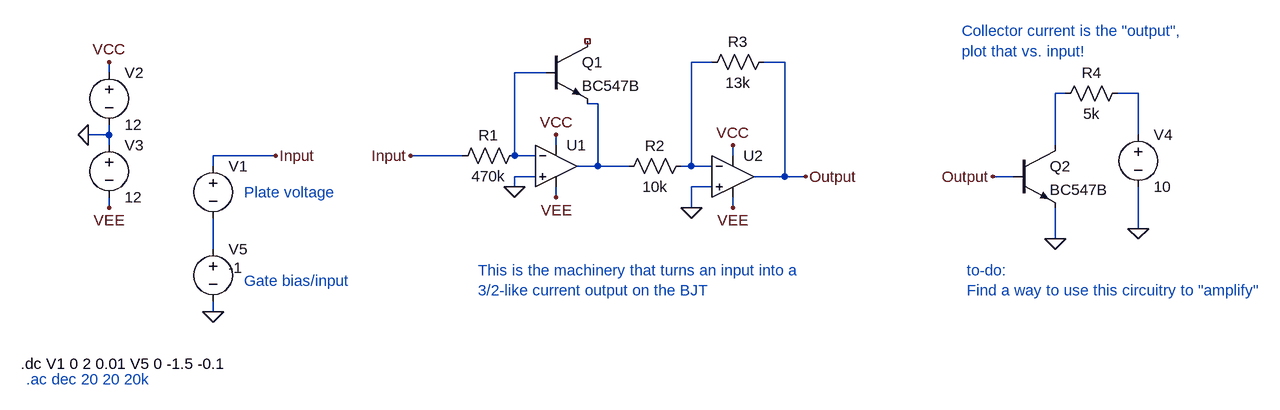
[diagram p0: schematic IV_family.asc]
IV_family.asc, the LTspice schematic file:
Version 4
SHEET 1 2184 680
WIRE 432 -16 400 -16
WIRE 544 -16 512 -16
WIRE -496 0 -496 -16
WIRE 176 0 128 0
WIRE 976 32 960 32
WIRE 1088 32 1056 32
WIRE 256 48 240 48
WIRE -496 96 -496 80
WIRE -496 96 -528 96
WIRE 1088 96 1088 32
WIRE -496 112 -496 96
WIRE 192 112 192 96
WIRE 960 112 960 32
WIRE -240 128 -336 128
WIRE 48 128 -32 128
WIRE 128 128 128 0
WIRE 160 128 128 128
WIRE 464 128 464 112
WIRE -336 144 -336 128
WIRE 256 144 256 48
WIRE 256 144 224 144
WIRE 304 144 256 144
WIRE 400 144 400 -16
WIRE 400 144 384 144
WIRE 432 144 400 144
WIRE 160 160 128 160
WIRE 544 160 544 -16
WIRE 544 160 496 160
WIRE 576 160 544 160
WIRE 896 160 864 160
WIRE 128 176 128 160
WIRE 432 176 400 176
WIRE 192 192 192 176
WIRE -496 208 -496 192
WIRE 400 208 400 176
WIRE 464 208 464 192
WIRE 1088 240 1088 176
WIRE 960 256 960 208
WIRE -336 272 -336 224
WIRE -336 368 -336 352
FLAG 128 176 0
FLAG -528 96 0
FLAG -496 -16 VCC
FLAG -496 208 VEE
FLAG 192 96 VCC
FLAG 192 192 VEE
FLAG 464 112 VCC
FLAG 464 208 VEE
FLAG 400 208 0
FLAG 1088 240 0
FLAG -336 368 0
FLAG 960 256 0
FLAG -240 128 Input
FLAG -32 128 Input
FLAG 576 160 Output
FLAG 864 160 Output
SYMBOL voltage -336 128 R0
WINDOW 123 32 85 Left 2
WINDOW 39 0 0 Left 0
SYMATTR InstName V1
SYMATTR Value ""
SYMBOL res 144 112 R90
WINDOW 0 0 56 VBottom 2
WINDOW 3 32 56 VTop 2
SYMATTR InstName R1
SYMATTR Value 470k
SYMBOL OpAmps\\UniversalOpAmp2 192 144 R0
SYMATTR InstName U1
SYMBOL voltage -496 -16 R0
WINDOW 123 0 0 Left 0
WINDOW 39 0 0 Left 0
SYMATTR InstName V2
SYMATTR Value 12
SYMBOL voltage -496 96 R0
WINDOW 123 0 0 Left 0
WINDOW 39 0 0 Left 0
SYMATTR InstName V3
SYMATTR Value 12
SYMBOL OpAmps\\UniversalOpAmp2 464 160 R0
SYMATTR InstName U2
SYMBOL res 400 128 R90
WINDOW 0 0 56 VBottom 2
WINDOW 3 32 56 VTop 2
SYMATTR InstName R2
SYMATTR Value 10k
SYMBOL res 528 -32 R90
WINDOW 0 0 56 VBottom 2
WINDOW 3 32 56 VTop 2
SYMATTR InstName R3
SYMATTR Value 13k
SYMBOL npn 896 112 R0
SYMATTR InstName Q2
SYMATTR Value BC547B
SYMBOL voltage 1088 80 R0
WINDOW 123 0 0 Left 0
WINDOW 39 0 0 Left 0
SYMATTR InstName V4
SYMATTR Value 10
SYMBOL res 1072 16 R90
WINDOW 0 0 56 VBottom 2
WINDOW 3 32 56 VTop 2
SYMATTR InstName R4
SYMATTR Value 5k
SYMBOL npn 176 -48 R0
SYMATTR InstName Q1
SYMATTR Value BC547B
SYMBOL voltage -336 256 R0
WINDOW 123 24 124 Left 2
WINDOW 39 0 0 Left 0
WINDOW 3 24 44 Left 2
SYMATTR InstName V5
SYMATTR Value -1
TEXT -632 448 Left 2 !.dc V1 0 2 0.01 V5 0 -1.5 -0.1
TEXT -624 472 Left 2 ;.ac dec 20 20 20k
TEXT 816 -64 Left 2 ;Collector current is the "output",\nplot that vs. input!
TEXT 824 304 Left 2 ;to-do:\nFind a way to use this circuitry to "amplify"
TEXT -288 320 Left 2 ;Gate bias/input
TEXT -288 184 Left 2 ;Plate voltage
TEXT 72 304 Left 2 ;This is the machinery that turns an input into a\n3/2-like current output on the BJT

The netlist it stands for:
* IV_family.asc
V1 Input N006
R1 N002 Input 470k
XU1 0 N002 VCC VEE N005 level2 Avol=1Meg GBW=10Meg Slew=10Meg Ilimit=25m Rail=0 Vos=0 En=0 Enk=0 In=0 Ink=0 Rin=500Meg  ; pins In+ In- V+ V- OUT
V2 VCC 0 12
V3 0 VEE 12
XU2 0 N001 VCC VEE Output level2 Avol=1Meg GBW=10Meg Slew=10Meg Ilimit=25m Rail=0 Vos=0 En=0 Enk=0 In=0 Ink=0 Rin=500Meg  ; pins In+ In- V+ V- OUT
R2 N001 N005 10k
R3 Output N001 13k
Q2 N003 Output 0 0 BC547B
V4 N004 0 10
R4 N004 N003 5k
Q1 NC_01 N002 N005 0 BC547B
V5 N006 0 -1
.model NPN NPN
.model PNP PNP
.lib standard.bjt
.dc V1 0 2 0.01 V5 0 -1.5 -0.1
* .ac dec 20 20 20k
* Collector current is the "output",
* plot that vs. input!
* to-do:
* Find a way to use this circuitry to "amplify"
* Gate bias/input
* Plate voltage
* This is the machinery that turns an input into a
* 3/2-like current output on the BJT
.lib UniversalOpAmp2.lib
.backanno
.end